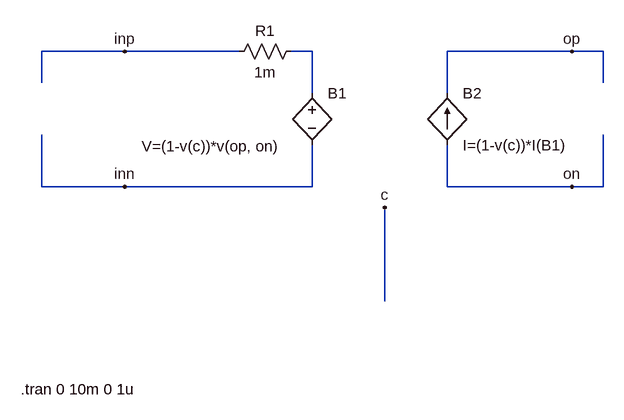
[diagram p0: schematic ccm1.asc]
ccm1.asc, the LTspice schematic file:
Version 4
SHEET 1 880 680
WIRE -96 16 -224 16
WIRE 80 16 -96 16
WIRE 192 16 160 16
WIRE 592 16 400 16
WIRE 640 16 592 16
WIRE -224 64 -224 16
WIRE 640 64 640 16
WIRE 192 80 192 16
WIRE 400 80 400 16
WIRE -224 224 -224 144
WIRE -96 224 -224 224
WIRE 192 224 192 160
WIRE 192 224 -96 224
WIRE 400 224 400 160
WIRE 592 224 400 224
WIRE 640 224 640 144
WIRE 640 224 592 224
WIRE 304 400 304 256
FLAG 304 256 c
FLAG -96 16 inp
FLAG -96 224 inn
FLAG 592 16 op
FLAG 592 224 on
SYMBOL bv 192 64 R0
WINDOW 3 -262 98 Left 2
SYMATTR Value V=(1-v(c))*v(op, on)
SYMATTR InstName B1
SYMBOL bi2 400 80 R0
SYMATTR InstName B2
SYMATTR Value I=(1-v(c))*I(B1)
SYMBOL res 176 0 R90
WINDOW 0 0 56 VBottom 2
WINDOW 3 32 56 VTop 2
SYMATTR InstName R1
SYMATTR Value 1m
TEXT -256 536 Left 2 !.tran 0 10m 0 1u

The netlist it stands for:
* ccm1.asc
B1 N001 inn V=(1-v(c))*v(op, on)
B2 on op I=(1-v(c))*I(B1)
R1 N001 inp 1m
.tran 0 10m 0 1u
.backanno
.end